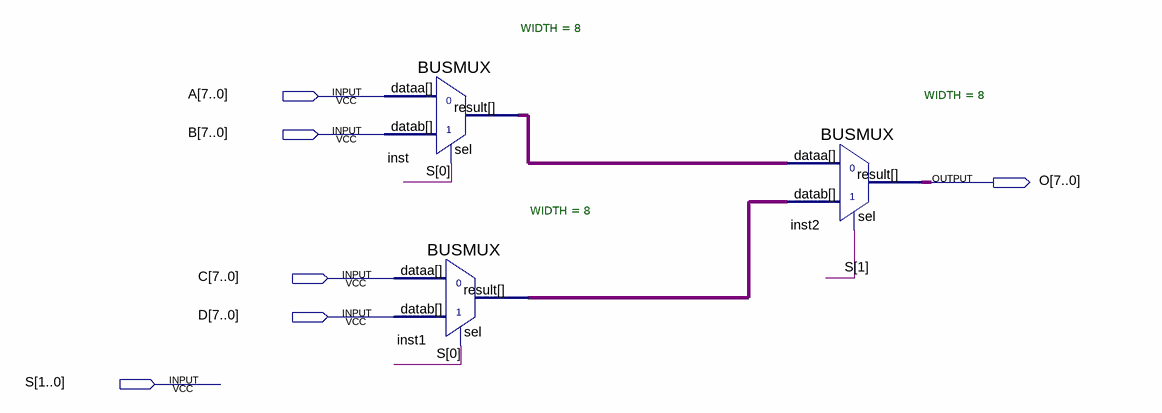
[diagram p0: schematic sheet]
// Quartus schematic Selector_4.bdf as structural Verilog: 3 symbols, 6 pins
module Selector_4 (
  input  [7:0] A,
  input  [7:0] B,
  input  [7:0] C,
  input  [7:0] D,
  input  [1:0] S,
  output [7:0] O
);

  wire [7:0] inst1_result, inst_result;

  BUSMUX #(.WIDTH(8)) inst (.datab(B), .sel(S[0]), .dataa(A), .result(inst_result));
  BUSMUX #(.WIDTH(8)) inst1 (.datab(D), .sel(S[0]), .dataa(C), .result(inst1_result));
  BUSMUX #(.WIDTH(8)) inst2 (.datab(inst1_result), .sel(S[1]), .dataa(inst_result), .result(O));
endmodule
